# EAGLE design imu_node (EAGLE 9.1.3)
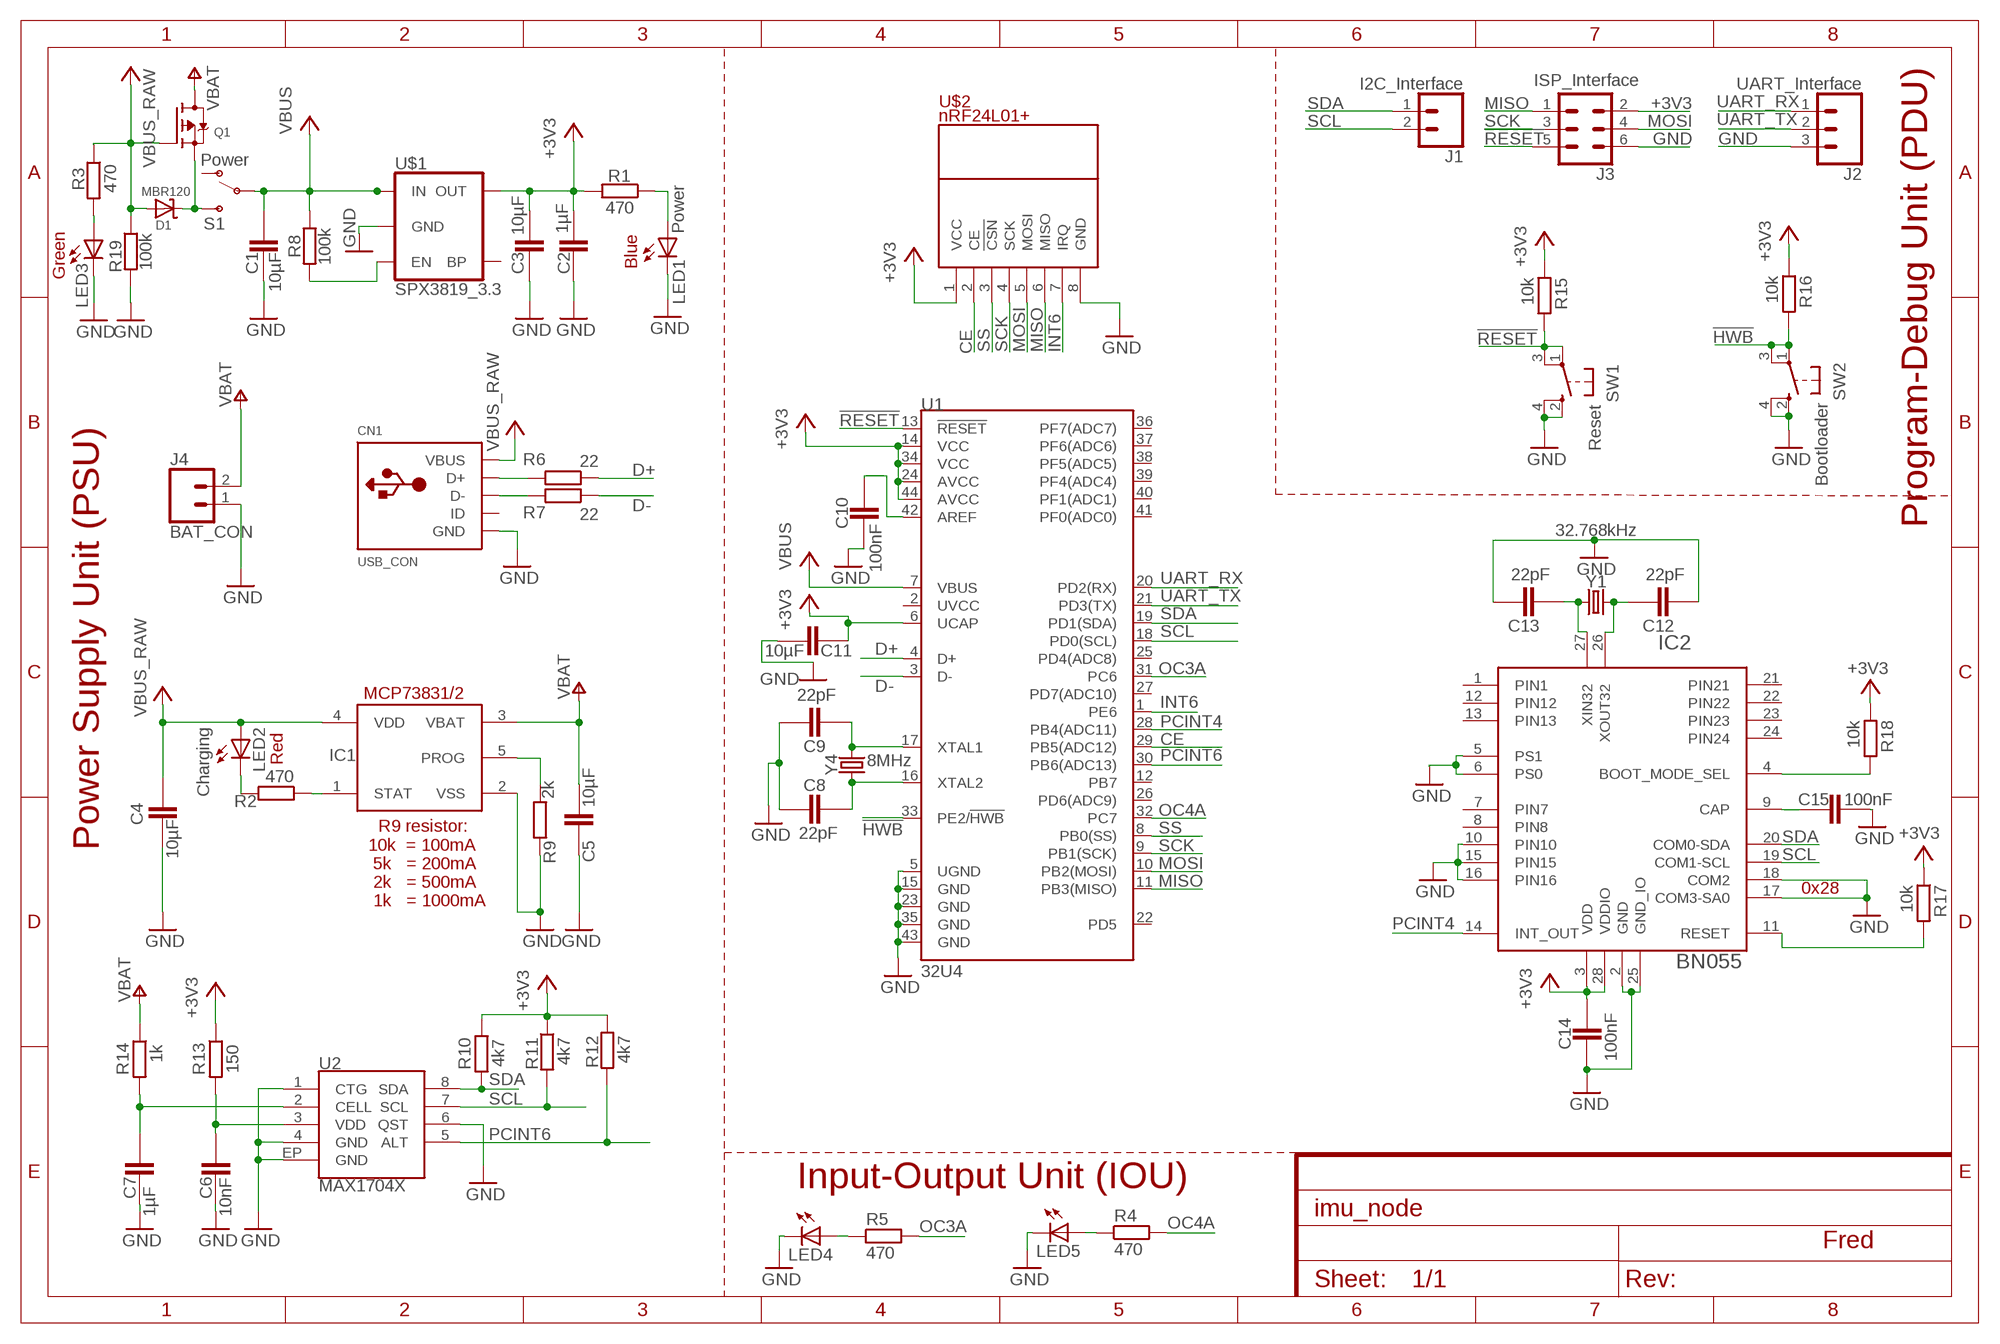
[diagram p0: schematic, sheet 1]

## Parts
C1  10µF  CAPACITOR_0603  [CAPC1608X92N]
C2  1µF  CAPACITOR_0603  [CAPC1608X92N]
C3  10µF  CAPACITOR_0603  [CAPC1608X92N]
C4  10µF  CAPACITOR_0603  [CAPC1608X92N]
C5  10µF  CAPACITOR_0603  [CAPC1608X92N]
C6  10nF  CAPACITOR_0603  [CAPC1608X92N]
C7  1µF  CAPACITOR_0603  [CAPC1608X92N]
C8  22pF  CAPACITOR_0603  [CAPC1608X92N]
C9  22pF  CAPACITOR_0603  [CAPC1608X92N]
C10  100nF  CAPACITOR_0603  [CAPC1608X92N]
C11  10µF  CAPACITOR_0603  [CAPC1608X92N]
C12  22pF  CAPACITOR_0603  [CAPC1608X92N]
C13  22pF  CAPACITOR_0603  [CAPC1608X92N]
C14  100nF  CAPACITOR_0603  [CAPC1608X92N]
C15  100nF  CAPACITOR_0603  [CAPC1608X92N]
CN1  USB_CON  USBMINIB  [USB-MINIB]
D1  MBR120  DIODE_SOD-123FL  [SOD-123FL]
IC1  MCP73831/OT  [SOT23-5L]
IC2  BN055  1658_BNO055  [LGA-28_3.80X5.20/0.5]
J1  I2C_Interface  CONN_02  [1X02]
J2  UART_Interface  CONN_03  [1X03]
J3  ISP_Interface  CONN_03X2FEMALE  [2X3]
J4  BAT_CON  CONN_02  [1X02]
LED1  Power  LEDCHIPLED_0603  [CHIPLED_0603]
LED2  Charging  LEDCHIPLED_0603  [CHIPLED_0603]
LED3  USB  LEDCHIPLED_0603  [CHIPLED_0603]
LED4  LEDCHIPLED_0603  [CHIPLED_0603]
LED5  LEDCHIPLED_0603  [CHIPLED_0603]
Q1  MICROBUILDER_MOSFET-P  [MICROBUILDER_SOT23-R]
R1  470  RESISTOR_0603  [RESC1608X55N]
R2  470  RESISTOR_0603  [RESC1608X55N]
R3  470  RESISTOR_0603  [RESC1608X55N]
R4  470  RESISTOR_0603  [RESC1608X55N]
R5  470  RESISTOR_0603  [RESC1608X55N]
R6  22  RESISTOR_0603  [RESC1608X55N]
R7  22  RESISTOR_0603  [RESC1608X55N]
R8  100k  RESISTOR_0603  [RESC1608X55N]
R9  2k  RESISTOR_0603  [RESC1608X55N]
R10  4k7  RESISTOR_0603  [RESC1608X55N]
R11  4k7  RESISTOR_0603  [RESC1608X55N]
R12  4k7  RESISTOR_0603  [RESC1608X55N]
R13  150  RESISTOR_0603  [RESC1608X55N]
R14  1k  RESISTOR_0603  [RESC1608X55N]
R15  10k  RESISTOR_0603  [RESC1608X55N]
R16  10k  RESISTOR_0603  [RESC1608X55N]
R17  10k  RESISTOR_0603  [RESC1608X55N]
R18  10k  RESISTOR_0603  [RESC1608X55N]
R19  100k  RESISTOR_0603  [RESC1608X55N]
S1  Power  SWITCH-SPDT-SMD-RIGHT-ANGLE  [SWITCH_SPST_SMD_A]
SW1  Reset  SPST_TACT-KMR2  [KMR2]
SW2  Bootloader  SPST_TACT-KMR2  [KMR2]
U1  32U4  ATMEGA32U4TQFP-44  [TQFP44]
U2  MAX1704X  [TDFN-8]
U$1  SPX3819_3.3  V_REG_SPX3819-SOT23-5  [SOT23-5]
U$2  nRF24L01+  6-PIN-BREAKOUT6-PIN-BREAKOUT  [6-PIN-BREAKOUT]
Y1  32.768kHz  CRYSTAL-32.768KHZSMD-3.2X1.5  [CRYSTAL-SMD-3.2X1.5MM]
Y4  8MHz  CRYSTAL-8MHZSMD-5X3.2  [CRYSTAL-SMD-5X3.2-4PAD]

## Nets
!HWB!: R16.2 SW2.1(P) SW2.3(P1) U1.33(PE2/!HWB)
!RESET!: J3.5 R15.2 SW1.1(P) SW1.3(P1) U1.13(!RESET)
+3V3: C2.2 C3.2 C11.1 C14.1 IC2.3(VDD) IC2.28(VDDIO) J3.2 R1.2 R10.1 R11.1 R12.1 R13.1 R15.1 R16.1 R17.1 R18.1 U1.6(UCAP) U1.14(VCC) U1.24(AVCC) U1.34(VCC) U1.44(AVCC) U$1.5(OUT) U$2.1(VCC)
CE: U1.29(PB5(ADC12)) U$2.2(CE)
D+: R6.1 U1.4(D+)
D-: R7.1 U1.3(D-)
GND: C1.1 C2.1 C3.1 C4.1 C5.1 C6.1 C7.1 C8.2 C9.2 C10.2 C11.2 C12.1 C13.2 C14.2 C15.2 CN1.GND IC1.2(VSS) IC2.2(GND) IC2.5(PS1) IC2.6(PS0) IC2.10(PIN10) IC2.15(PIN15) IC2.16(PIN16) IC2.17(COM3-SA0) IC2.18(COM2) IC2.25(GND_IO) J2.3 J3.6 J4.1 LED1.C LED3.C LED4.C LED5.C R9.2 R19.2 SW1.2(S) SW1.4(S1) SW2.2(S) SW2.4(S1) U1.5(UGND) U1.15(GND) U1.23(GND) U1.35(GND) U1.43(GND) U2.1(CTG) U2.4(GND) U2.6(QST) U2.EP(GND) U$1.2(GND) U$2.8(GND)
INT6: U1.1(PE6) U$2.7(IRQ)
MISO: J3.1 U1.11(PB3(MISO)) U$2.6(MISO)
MOSI: J3.4 U1.10(PB2(MOSI)) U$2.5(MOSI)
N$1: CN1.D+ R6.2
N$2: CN1.D- R7.2
N$3: IC1.5(PROG) R9.1
N$4: LED2.C R2.2
N$5: R8.2 U$1.3(EN)
N$6: C13.1 IC2.27(XIN32) Y1.P$1
N$7: LED1.A R1.1
N$8: IC1.1(STAT) R2.1
N$9: LED3.A R3.2
N$10: C9.1 U1.17(XTAL1) Y4.3
N$11: C8.1 U1.16(XTAL2) Y4.1
N$12: C10.1 U1.42(AREF)
N$13: C6.2 R13.2 U2.3(VDD)
N$14: C7.2 R14.2 U2.2(CELL)
N$15: LED4.A R5.1
N$16: C12.2 IC2.26(XOUT32) Y1.P$2
N$17: LED5.A R4.1
N$18: D1.C Q1.2(S) S1.3(S)
N$19: IC2.11(RESET) R17.2
N$20: C15.1 IC2.9(CAP)
N$21: IC2.4(BOOT_MODE_SEL) R18.2
OC3A: R5.2 U1.31(PC6)
OC4A: R4.2 U1.32(PC7)
PCINT4: IC2.14(INT_OUT) U1.28(PB4(ADC11))
PCINT6: R12.2 U1.30(PB6(ADC13)) U2.5(ALT)
SCK: J3.3 U1.9(PB1(SCK)) U$2.4(SCK)
SCL: IC2.19(COM1-SCL) J1.2 R11.2 U1.18(PD0(SCL)) U2.7(SCL)
SDA: IC2.20(COM0-SDA) J1.1 R10.2 U1.19(PD1(SDA)) U2.8(SDA)
SS: U1.8(PB0(SS)) U$2.3(!CSN!)
UART_RX: J2.1 U1.20(PD2(RX))
UART_TX: J2.2 U1.21(PD3(TX))
VBAT: C5.2 IC1.3(VBAT) J4.2 Q1.3(D) R14.1
VBUS: C1.2 R8.1 S1.2(P) U1.7(VBUS) U$1.1(IN)
VBUS_RAW: C4.2 CN1.VBUS D1.A IC1.4(VDD) LED2.A Q1.1(G) R3.1 R19.1
Unconnected: CN1.ID IC2.1(PIN1) IC2.7(PIN7) IC2.8(PIN8) IC2.12(PIN12) IC2.13(PIN13) IC2.21(PIN21) IC2.22(PIN22) IC2.23(PIN23) IC2.24(PIN24) S1.1(O) U1.2(UVCC) U1.12(PB7) U1.22(PD5) U1.25(PD4(ADC8)) U1.26(PD6(ADC9)) U1.27(PD7(ADC10)) U1.36(PF7(ADC7)) U1.37(PF6(ADC6)) U1.38(PF5(ADC5)) U1.39(PF4(ADC4)) U1.40(PF1(ADC1)) U1.41(PF0(ADC0)) U$1.4(BP)

## Notes on the sheet
- Program-Debug Unit (PDU)
- nRF24L01+
- Blue
- Green
- Red
- Power Supply Unit (PSU)
- 0x28
- R9 resistor:
  10k  = 100mA
   5k   = 200mA
   2k   = 500mA
   1k   = 1000mA
- Input-Output Unit (IOU)
- Fred

## Library data of the parts
C1-C15 = ipc-7351-capacitor:CAPACITOR_
CN1 = adafruit:USB: USB Connectors USBMINIB - Surface Mount Female Mini-B USB Connector 4UConnector: 06564 By microbuilder.eu Thru-hole RA Female Mini-B USB Connector 4UConnector: 18732 By ladyada.net
D1 = adafruit:DIODE: Diode SMADIODE - SMA Surface Mount Package 20V 1A Schottky Diode Digikey: 641-1014-6-ND DO-1N4148 - Through Hole Small Current Diode SOD-123 20V 1 A (.5mV Vf) Schottky Diode - Digikey: MBRX120TPMSCT-ND SOD-323 10V 570mA (.38mV Vf, 3ns) Schottky Diode - Digikey: ZLLS410CT-ND SOD-523 30V 30mA Schottky Diode (RB751S-40TE61) - Digikey: RB751S-40TE61CT-ND SOT23-R/W - SOT23 Package (R = Solder Paste/Reflow Ovens, W = Hand-Soldering) BAT54Film 40V 300mA - Digikey: 497-7162-1-ND
IC1 = adafruit:MCP73831: MCP73831/2 Miniature Single-Cell, Fully Integrated Li-Ion, Li-Polymer Charge Management Controllers. Nice and small simple lipoly charge controller, with adjustable current and status output (LED) http://www.ladyada.net/library/pcb/eaglelibrary.html
IC2 = BNO055:1658_BNO055: BN055 Intelligent 9-axis absolute orientation sensor; PART_NUMBER: BNO055
J1 J4 = SparkFun-Connectors:CONN_02: Multi connection point. Often used as Generic Header-pin footprint for 0.1 inch spaced/style header connections On any of the 0.1 inch spaced packages, you can populate with these: Break Away Headers - Straight <https://www.sparkfun.com/products/116> (PRT-00116) Break Away Male Headers - Right Angle <https://www.sparkfun.com/products/553> (PRT-00553) Female Headers <https://www.sparkfun.com/products/115> (PRT-00115) Break Away Headers - Machine Pin <https://www.sparkfun.com/products/117> (PRT-00117) Break Away Female Headers - Swiss Machine Pin <https://www.sparkfun.com/products/743> (PRT-00743) For SCREWTERMINALS and SPRING TERMINALS visit here: Screw Terimnals on SparkFun.com <https://www.sparkfun.com/search/results?term=Screw+Terminals> (5mm/3.5mm/2.54mm spacing) This device is also useful as a general connection point to wire up your design to another part of your project. Our various solder wires solder well into these plated through hole pads. Hook-Up Wire - Assortment (Stranded, 22 AWG) <https://www.sparkfun.com/products/11375> (PRT-11375) Hook-Up Wire - Assortment (Solid Core, 22 AWG) <https://www.sparkfun.com/products/11367> (PRT-11367) View the entire wire category on our website here <https://www.sparkfun.com/categories/141> Special notes: Molex polarized connector foot print use with: PRT-08233 with associated crimp pins and housings. 2.54_SCREWTERM for use with PRT-10571. 3.5mm Screw Terminal footprints for PRT-08084 5mm Screw Terminal footprints for use with PRT-08432
J2 = SparkFun-Connectors:CONN_03: Multi connection point. Often used as Generic Header-pin footprint for 0.1 inch spaced/style header connections On any of the 0.1 inch spaced packages, you can populate with these: Break Away Headers - Straight <https://www.sparkfun.com/products/116> (PRT-00116) Break Away Male Headers - Right Angle <https://www.sparkfun.com/products/553> (PRT-00553) Female Headers <https://www.sparkfun.com/products/115> (PRT-00115) Break Away Headers - Machine Pin <https://www.sparkfun.com/products/117> (PRT-00117) Break Away Female Headers - Swiss Machine Pin <https://www.sparkfun.com/products/743> (PRT-00743) Stackable Header - 3 Pin (Female, 0.1") <https://www.sparkfun.com/products/13875> (PRT-13875) For SCREWTERMINALS and SPRING TERMINALS visit here: Screw Terimnals on SparkFun.com <https://www.sparkfun.com/search/results?term=Screw+Terminals> (5mm/3.5mm/2.54mm spacing) This device is also useful as a general connection point to wire up your design to another part of your project. Our various solder wires solder well into these plated through hole pads. Hook-Up Wire - Assortment (Stranded, 22 AWG) <https://www.sparkfun.com/products/11375> (PRT-11375) Hook-Up Wire - Assortment (Solid Core, 22 AWG) <https://www.sparkfun.com/products/11367> (PRT-11367) View the entire wire category on our website here <https://www.sparkfun.com/categories/141> Special notes: Molex polarized connector foot print use with SKU : PRT-08232 with associated crimp pins and housings.; PROD_ID: XXX-00000; VALUE: 455-1750-1-ND
J3 = SparkFun-Connectors:CONN_03X2: Multi connection point. Often used as Generic Header-pin footprint for 0.1 inch spaced/style header connections You can populate with any combo of single row headers, but if you'd like an exact match, check these: Header - 2x3 (Male, 0.1") <https://www.sparkfun.com/products/12807> (PRT-12807) Header - 2x3 (Female, 0.1") <https://www.sparkfun.com/products/13010> (PRT-13010) 2x3 Pin Shrouded Header <https://www.sparkfun.com/products/10877> (PRT-10877) On any of the 0.1 inch spaced packages, you can populate with these: Break Away Headers - Straight <https://www.sparkfun.com/products/116> (PRT-00116) Break Away Male Headers - Right Angle <https://www.sparkfun.com/products/553> (PRT-00553) Female Headers <https://www.sparkfun.com/products/115> (PRT-00115) Break Away Headers - Machine Pin <https://www.sparkfun.com/products/117> (PRT-00117) Break Away Female Headers - Swiss Machine Pin <https://www.sparkfun.com/products/743> (PRT-00743) Special note: the shrouded connector mates well with our 3x2 ribbon cables: Ribbon Crimp Connector - 6-pin (2x3, Female) <https://www.sparkfun.com/products/10651> (PRT-10651) Ribbon Cable - 6 wire (15ft) <https://www.sparkfun.com/products/10646> (PRT-10646); PROD_ID: CONN-11566; VALUE: FEMALE 2x3
LED1-LED5 = adafruit:LED: LED OSRAM: - CHIPLED LG R971, LG N971, LY N971, LG Q971, LY Q971, LO R971, LY R971 LH N974, LH R974 LS Q976, LO Q976, LY Q976 LO Q996 - Hyper CHIPLED LW Q18S LB Q993, LB Q99A, LB R99A - SideLED LS A670, LO A670, LY A670, LG A670, LP A670 LB A673, LV A673, LT A673, LW A673 LH A674 LY A675 LS A676, LA A676, LO A676, LY A676, LW A676 LS A679, LY A679, LG A679 - Hyper Micro SIDELED® LS Y876, LA Y876, LO Y876, LY Y876 LT Y87S - SmartLED LW L88C, LW L88S LB L89C, LB L89S, LG L890 LS L89K, LO L89K, LY L89K LS L896, LA L896, LO L896, LY L896 - TOPLED LS T670, LO T670, LY T670, LG T670, LP T670 LSG T670, LSP T670, LSY T670, LOP T670, LYG T670 LG T671, LOG T671, LSG T671 LB T673, LV T673, LT T673, LW T673 LH T674 LS T676, LA T676, LO T676, LY T676, LB T676, LH T676, LSB T676, LW T676 LB T67C, LV T67C, LT T67C, LS T67K, LO T67K, LY T67K, LW E67C LS E67B, LA E67B, LO E67B, LY E67B, LB E67C, LV E67C, LT E67C LW T67C LS T679, LY T679, LG T679 LS T770, LO T770, LY T770, LG T770, LP T770 LB T773, LV T773, LT T773, LW T773 LH T774 LS E675, LA E675, LY E675, LS T675 LS T776, LA T776, LO T776, LY T776, LB T776 LHGB T686 LT T68C, LB T68C - Hyper Mini TOPLED® LB M676 - Mini TOPLED Santana® LG M470 LS M47K, LO M47K, LY M47K Source: http://www.osram.convergy.de/
Q1 = Adafruit Feather 328P:MICROBUILDER_MOSFET-P: P-Channel Mosfet LEGEND VDS: Voltage Drain-Source ID: Drain Current RDS(ON): Drain-Source On-State Resistance VGS(TH): Gate-Source Threshold Voltage CISS: Drain-Source Input Capacitance SOT-23 Name VDS ID RDS(ON) VGS(TH) CISS Order Number IRLML5103 30V 760mA 600 mOhm -- 75pF @ 25V Digikey: IRLML5103PBFCT-ND IRLML6401 12V 4.3A 50 mOhm 950mV @ 250µA 830pF @ 10V Digikey: IRLML6401PBFTR-ND NTR0202PL 20V 400mA 800 mOhm 2.3V @ 250uA 70pF @ 5V Digikey: NTR0202PLT1GOSTR-ND NTR4101PT1G 20V 1.8A 85 mOhm 1.2V @ 250uA 675pF @ 10V Digikey: NTR4101PT1GOSCT-ND DMP2004K 20V 600mA 900 mOhm 1V @ 250uA 175pF @ 16V Digikey: DMP2004KDICT-ND PMV65XP 20V 3.9A 76 mOhm 950mV @ 1mA 725pF @ 20V Digikey: 568-2358-2-ND TO-252 Name VDS ID RDS(ON) VGS(TH) CISS Order Number AOD417 30V 25A 34 mOhm 3V @ 250µA 920pF @ 15V Digikey: 785-1106-2-ND PowerPak Name VDS ID RDS(ON) VGS(TH) CISS Order Number AON7401 30V 12A 14 mOhm 3V @ 250µA 2600pF @ 15V Digikey: 785-1302-1-ND
R1-R19 = ipc-7351-resistor:RESISTOR_
S1 = SparkFun-Switches:SWITCH-SPDT: Single Pole, Double Throw (SPDT) Switch Single-pole, double-throw (SPDT) switch. Variant Overview SMD-AYZ0202 Surface Mount DPDT Switch <https://www.sparkfun.com/products/597> (COM-00597) Used on e.g. LilyPad Arduino USB - ATmega32U4 Board <https://www.sparkfun.com/products/12049> PTH-11.6X4.0MM SPDT Mini Power Switch <https://www.sparkfun.com/products/102> (COM-00102) Used on e.g. SparkFun Simon Says - Through-Hole Soldering Kit <https://www.sparkfun.com/products/10547> (KIT-10547) PTH-11.6X4.0MM-KIT KIT version of SPDT Mini Power Switch - Simplifies soldering by removing tStop of switch pins - only one side can be soldered. PTH-11.6X4.0MM-LOCK LOCK version of SPDT Mini Power Switch - Offset pins hold switch in place for easier soldering. SMD-RIGHT-ANGLE Surface Mount Right Angle Switch <https://www.sparkfun.com/products/10860> (COM-10860) Used on e.g. SparkFun ESP8266 Thing <https://www.sparkfun.com/products/13231>; PROD_ID: SWCH-10651; SF_SKU: COM-10860
SW1 SW2 = adafruit:SPST_TACT: SMT 6mm switch, EVQQ2 series http://www.ladyada.net/library/eagle
U1 = SparkFun-IC-Microcontroller:ATMEGA32U4: Atmel MCU, 32KByte Atmel 44-pin 8-bit Microcontroller with 32KBytes of ISP Flash and USB Controller Datasheet <http://cdn.sparkfun.com/datasheets/Dev/Arduino/Boards/ATMega32U4.pdf> SparkFun Products LilyPad Arduino USB - ATmega32U4 Board <https://www.sparkfun.com/products/12049> (DEV-12049) Pro Micro - 5V/16MHz <https://www.sparkfun.com/products/12640> (DEV-12640) Pro Micro - 3.3V/8MHz <https://www.sparkfun.com/products/12587> (DEV-12587) Fio v3 - ATmega32U4 <https://www.sparkfun.com/products/11520> (DEV-11520) Qduino Mini <https://www.sparkfun.com/products/13614> (DEV-13614) Makey Makey - Standard Kit <https://www.sparkfun.com/products/11511> (WIG-11511) Makey Makey Deluxe Kit <https://www.sparkfun.com/products/11519> (WIG-11519); PROD_ID: IC-11161
U2 = SparkFun-IC-Power:MAX1704X: MAX17043/MAX17044: Battery Fuel Guage (43 is 1cell, 44 is 2cell); PROD-ID: IC-10399
U$1 = SparkFun-IC-Power:V_REG_SPX3819: SPX3819 Voltage Regulator 3.3V 500mA, 16V input Datasheet <https://www.exar.com/content/document.ashx?id=22106> SparkFun Products: SparkFun Serial Controlled Motor Driver <https://www.sparkfun.com/products/13911>; PROD_ID: VREG-13321; VALUE: SPX3819M5_3_3
U$2 = SparkFun-nRF24L01+:6-PIN-BREAKOUT
Y1 = SparkFun-Clocks:CRYSTAL-32.768KHZ: 32.768kHz Crystal Frequency: 32.768kHz Frequency Stability: ±20ppm Load Capacitance: 12.5pF (PTH-2X6 & SMD-3.2X1.5), 6pF (SMD-2X6) SparkFun Products: SparkFun BigTime Watch Kit <https://www.sparkfun.com/products/11734> SparkFun nRF52832 Breakout <https://www.sparkfun.com/products/13990> SparkFun Real Time Clock Module <https://www.sparkfun.com/products/12708>; PROD_ID: XTAL-13062
Y4 = SparkFun-Clocks:CRYSTAL-8MHZ: 8MHz Crystal Datasheet Example <http://www.futureelectronics.com/en/technologies/electromechanical/timing-devices/crystals/Pages/6008189-ABM3B-8.000MHZ-B2-T.aspx?IM=0> Frequency: 8MHz Frequency Tolerance: ±20ppm Load Capacitance: 18pF SparkFun Products: Pro Micro -3.3V/8MHz <https://www.sparkfun.com/products/12587> WAV Trigger <https://www.sparkfun.com/products/13660>; PROD_ID: XTAL-09431

## Board
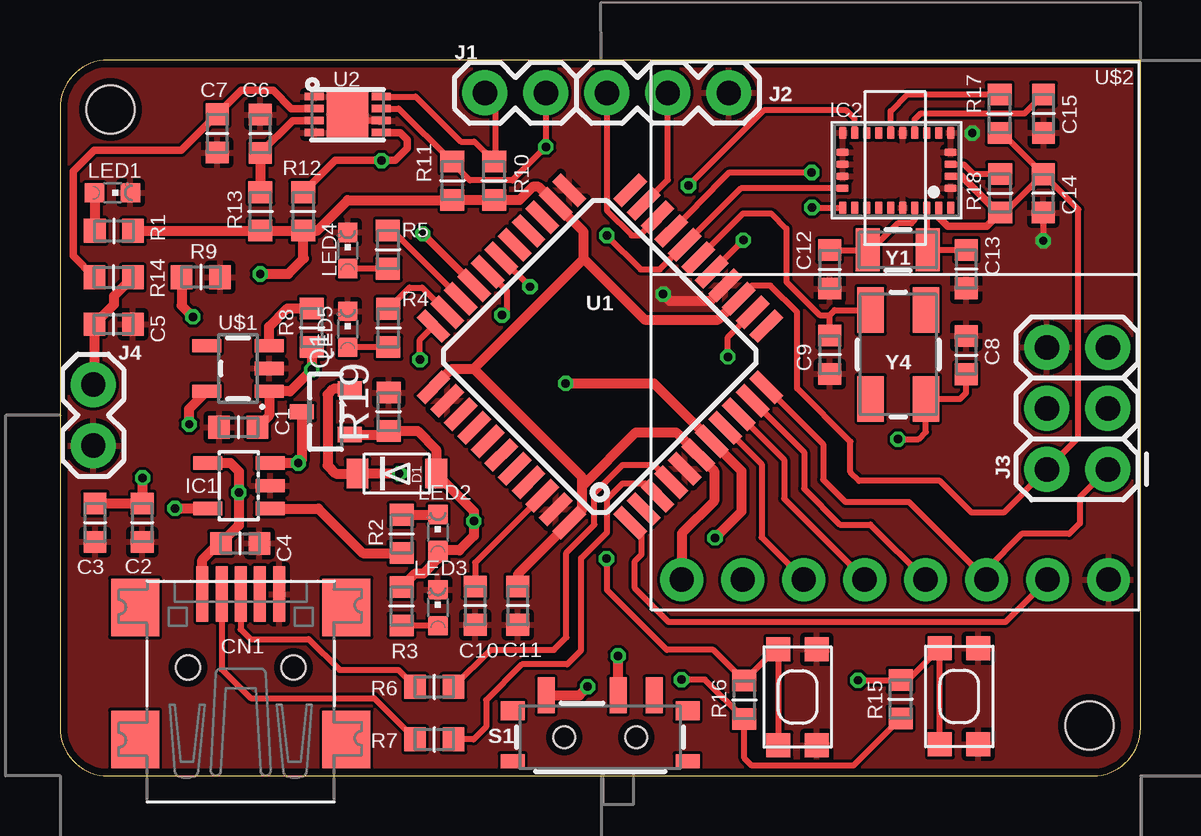
[diagram p1: board, top side]
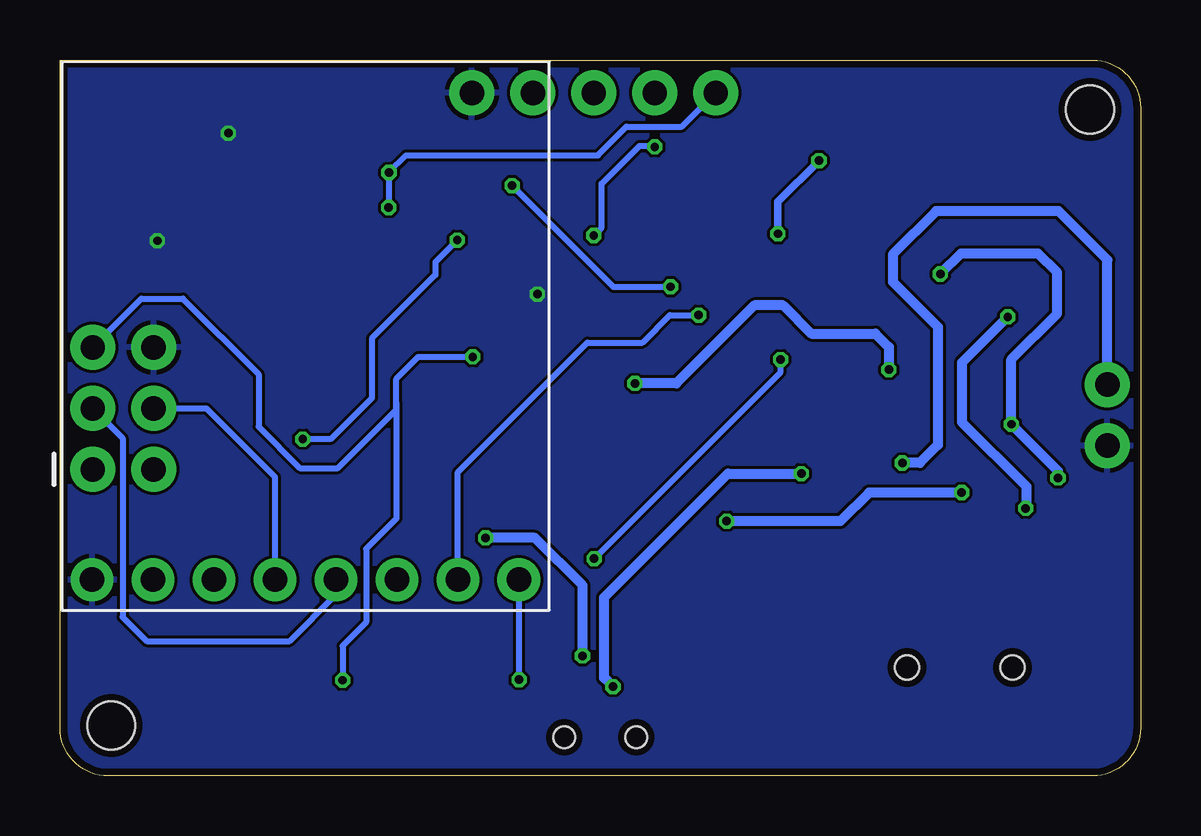
[diagram p2: board, bottom side, seen from below]

Size 45.02 x 29.83 mm. Coordinates in mm from the lower left corner, seen from the top.
Outline: 0,27.83 0,2 arc90 2,0 43.02,0 arc90 45.02,2 45.02,29.83 2,29.83 arc90 0,27.83
Copper layers (1*16): Top 0.035mm / dielectric 1.5mm / Bottom 0.035mm
Design rules "PCB-POOL HighSpec": minimum track width 0.125mm, minimum drill 0.2mm, track to track 0.125mm, track to pad 0.125mm, pad to pad 0.125mm, via to via 0.125mm, smd to smd 0.125mm, copper to edge 0.3mm, drill to drill 0.2mm, minimum pad ring 0.2mm, minimum via ring 0.125mm, stop-mask expansion 0.075mm, vias tented up to drill 0mil, thermal gap 0.2mm
Holes 2 mm at 42.89,2.11 2.11,27.76

### Footprints (pad centres in the part's own frame; a part is rotated, then mirrored left to right if it is on the bottom)
CAPC1608X92N = smd 0.9 x 0.95: 1 -0.8,0; 2 0.8,0
USB-MINIB = smd 0.5 x 2.308: D+ 0,4.064; D- -0.8,4.064; GND 1.6,4.064; ID 0.8,4.064; VBUS -1.6,4.064 | smd 2 x 2.4: GND1 -4.4,-2; GND2 -4.4,3.5; GND3 4.4,3.5; GND4 4.4,-2 | hole 1: -2.2,1; 2.2,1
SOD-123FL = smd 0.91 x 1.22: A 1.637,0; C -1.637,0
SOT23-5L = smd 0.55 x 1.2: 1 -0.95,-1.3; 2 0,-1.3; 3 0.95,-1.3; 4 0.95,1.3; 5 -0.95,1.3
LGA-28_3.80X5.20/0.5 = smd 0.3 x 0.5: 1 -2.25,1.56; 6 -2.25,-1.56; 7 -1.75,-1.56; 8 -1.25,-1.56; 9 -0.75,-1.56; 10 -0.25,-1.56; 11 0.25,-1.56; 12 0.75,-1.56; 13 1.25,-1.56; 14 1.75,-1.56; 15 2.25,-1.56; 20 2.25,1.56; 21 1.75,1.56; 22 1.25,1.56; 23 0.75,1.56; 24 0.25,1.56; 25 -0.25,1.56; 26 -0.75,1.56; 27 -1.25,1.56; 28 -1.75,1.56 | smd 0.5 x 0.3: 2 -2.25,0.75; 3 -2.25,0.25; 4 -2.25,-0.25; 5 -2.25,-0.75; 16 2.25,-0.75; 17 2.25,-0.25; 18 2.25,0.25; 19 2.25,0.75
1X02 = drill 1.016 pad 1.88: 1 0,0; 2 2.54,0
1X03 = drill 1.016 pad 1.88: 1 0,0; 2 2.54,0; 3 5.08,0
2X3 = drill 1.016 pad 1.88: 1 0,0; 2 0,2.54; 3 2.54,0; 4 2.54,2.54; 5 5.08,0; 6 5.08,2.54
CHIPLED_0603 = smd 0.8 x 0.8: A 0,-0.75; C 0,0.75
MICROBUILDER_SOT23-R = smd 0.635 x 1.016: 1 -0.95,-1; 2 0.95,-1; 3 0,1
RESC1608X55N = smd 0.9 x 1: 1 -0.8,0; 2 0.8,0
SWITCH_SPST_SMD_A = smd 0.7 x 1.5: 1 -2.25,-1.75; 2 -0.75,-1.75; 3 2.25,-1.75 | smd 1 x 0.6: GND1 -3.65,1; GND3 3.65,1 | smd 1 x 0.8: GND2 -3.65,-1.1; GND4 3.65,-1.1 | hole 0.9: -1.5,0; 1.5,0
KMR2 = smd 1 x 1: 1 2,0.8; 2 2,-0.8; 3 -2,0.8; 4 -2,-0.8
TQFP44 = smd 1.5 x 0.5: 1 -5.8,4; 2 -5.8,3.2; 3 -5.8,2.4; 4 -5.8,1.6; 5 -5.8,0.8; 6 -5.8,0; 7 -5.8,-0.8; 8 -5.8,-1.6; 9 -5.8,-2.4; 10 -5.8,-3.2; 11 -5.8,-4; 23 5.8,-4; 24 5.8,-3.2; 25 5.8,-2.4; 26 5.8,-1.6; 27 5.8,-0.8; 28 5.8,0; 29 5.8,0.8; 30 5.8,1.6; 31 5.8,2.4; 32 5.8,3.2; 33 5.8,4 | smd 0.5 x 1.5: 12 -4,-5.8; 13 -3.2,-5.8; 14 -2.4,-5.8; 15 -1.6,-5.8; 16 -0.8,-5.8; 17 0,-5.8; 18 0.8,-5.8; 19 1.6,-5.8; 20 2.4,-5.8; 21 3.2,-5.8; 22 4,-5.8; 34 4,5.8; 35 3.2,5.8; 36 2.4,5.8; 37 1.6,5.8; 38 0.8,5.8; 39 0,5.8; 40 -0.8,5.8; 41 -1.6,5.8; 42 -2.4,5.8; 43 -3.2,5.8; 44 -4,5.8
TDFN-8 = smd 0.8 x 0.3: 1 -1.4,0.75; 2 -1.4,0.25; 3 -1.4,-0.25; 4 -1.4,-0.75; 5 1.4,-0.75; 6 1.4,-0.25; 7 1.4,0.25; 8 1.4,0.75 | smd 1.73 x 1.88: EP 0,0
SOT23-5 = smd 0.55 x 1.2: 1 -0.95,-1.3; 2 0,-1.3; 3 0.95,-1.3; 4 0.95,1.3; 5 -0.95,1.3
6-PIN-BREAKOUT = drill 1.016 pad 1.778: 1 0,0; 2 2.54,0; 3 5.08,0; 4 7.62,0; 5 10.16,0; 6 12.7,0; 7 15.24,0; 8 17.78,0
CRYSTAL-SMD-3.2X1.5MM = smd 1 x 1.8: P$1 -1.25,0; P$2 1.25,0
CRYSTAL-SMD-5X3.2-4PAD = smd 1.9 x 1.1: 1 -1.85,-1.15; 2 1.85,-1.15; 3 1.85,1.15; 4 -1.85,1.15

### Placement (x,y rotation side)
C1  7.43,14.53 0 top
C2  3.43,10.55 90 top
C3  1.46,10.55 90 top
C4  7.51,9.69 180 top
C5  2.24,18.82 180 top
C6  8.34,26.76 270 top
C7  6.55,26.77 90 top
C8  37.76,17.54 90 top
C9  32.07,17.55 270 top
C10  17.3,7.1 270 top
C11  19.08,7.1 270 top
C12  32.07,21.11 90 top
C13  37.76,21.12 270 top
C14  40.97,24.27 270 top
C15  40.98,27.6 270 top
CN1  7.53,3.52 0 top
D1  14.03,12.6 0 top
IC1  7.45,12.09 90 top
IC2  34.86,25.23 180 top
J1  17.7,28.46 0 top
J2  22.78,28.46 0 top
J3  43.66,12.78 90 top
J4  1.38,13.77 90 top
LED1  2.18,24.3 270 top
LED2  15.75,10.15 0 top
LED3  15.75,7.01 0 top
LED4  11.99,21.89 0 top
LED5  11.99,18.62 0 top
Q1  11.07,15.18 90 top
R1  2.25,22.71 0 top
R2  14.24,10.08 90 top
R3  14.24,7.07 270 top
R4  13.68,18.67 90 top
R5  13.67,21.93 90 top
R6  15.6,3.71 180 top
R7  15.6,1.52 180 top
R8  10.49,18.68 90 top
R9  5.87,20.79 0 top
R10  18.08,24.8 90 top
R11  16.34,24.8 90 top
R12  10.13,23.52 90 top
R13  8.34,23.52 90 top
R14  2.24,20.78 180 top
R15  35.03,3.2 90 top
R16  28.51,3.17 90 top
R17  39.15,27.6 90 top
R18  39.17,24.28 90 top
R19  13.69,15.18 90 top
S1  22.5,1.61 180 top
SW1  37.47,3.31 90 top
SW2  30.73,3.29 90 top
U1  22.49,17.48 135 top
U2  11.99,27.56 0 top
U$1  7.42,16.98 90 top
U$2  25.91,8.18 0 top
Y1  34.91,21.92 180 top
Y4  34.92,17.56 90 top

### Tracks (layer width: path | path; a pad name or v marks a point on that pad's centre or on a via)
!HWB!  (via drill 0.35)
  Top 0.254: v22.77,9.05 22.78,9.04 22.8,9.04 22.8,7.75 25.29,5.26 27.23,5.26 R16.2 29.83,5.29 SW2.1 SW2.3 | U1.33 15,18.18 v15,17.35
  Bottom 0.254: v22.77,9.05 15,16.83 v15,17.35
!RESET!  (via drill 0.35)
  Top 0.254: v27.83,17.46 27.83,18.28 U1.13 | v33.25,3.99 35.01,3.99 R15.2 | R15.2 35.35,4 | SW1.3 SW1.1 35.35,4 | R15.2 35.35,4
  Bottom 0.254: J3.5 41.63,19.89 39.9,19.89 36.75,16.74 36.75,14.55 35.03,12.83 33.45,12.83 31.01,15.27 31.01,15.53 | 31.01,15.53 31.01,16.55 30.1,17.46 v27.83,17.46 | 31.01,15.53 31.01,10.72 32.27,9.46 32.27,6.4 33.25,5.42 v33.25,3.99
+3V3  (via drill 0.35)
  Top 0.254: R18.1 39.11,23.48 R18.1 39.38,23.48 | R17.1 39.24,26.8 C14.1 | C14.1 39.38,23.48 | 39.38,23.48 | U1.14 28.29,19.89 28.83,20.43 29.6,20.43 30.71,19.33 30.71,16.15 32.93,13.93 32.93,12.66 33.3,12.29 36.66,12.29 37.99,10.97 39.32,10.97 J3.2 42.43,14.08 42.43,23.61 C14.1 | R15.1 33.05,0.43 28.83,0.43 28.51,0.74 R16.1 26.87,4.01 v25.89,4.01
  Top 0.305: IC2.28 36.61,23.28 36.98,22.91 38.61,22.91 R18.1 39.08,23.48 37.88,24.68 | IC2.3 37.58,24.98 37.88,24.68 | 37.88,24.68
  Top 0.406: U1.34 16.33,16.97 17.23,16.97 | 17.23,16.97 21.82,21.55 | 21.82,21.55 21.82,22.67 20.83,23.66 U1.24 19.94,24.55 19.7,24.55 19.14,23.99 R10.1 R11.1 11.99,23.99 10.72,22.72 R12.1 | 21.82,21.55 24.36,19.01 27.42,19.01 U1.14 | U$2.1 25.91,10.11 27.25,11.46 27.25,12.71 U1.6 26.59,13.39 25.67,14.31 23.99,14.31 21.75,12.08 | C11.1 19.07,8.4 U1.44 21.75,11.08 21.75,12.08 | C3.2 C2.2 3.44,11.37 v3.44,12.42 | v5.38,14.66 5.38,15.3 U$1.5 | 21.75,12.08 21.75,12.45 17.23,16.97 | R12.1 R13.1 8.33,22.71 R1.2 | v8.34,20.92 9.51,20.92 10.16,21.57 10.13,21.59 R12.1
  Bottom 0.254: v25.89,4.01 25.89,8.17 U$2.1
  Bottom 0.406: v8.34,20.92 7.49,21.77 4.27,21.77 3.48,20.98 3.48,19.27 5.38,17.36 v5.38,14.66 3.44,12.71 v3.44,12.42
CE  (via drill 0.35)
  Top 0.254: v18.41,19.2 18.63,19.42 18.63,20.21 U1.29
  Bottom 0.254: U$2.2 28.45,12.66 23.05,18.06 20.75,18.06 19.61,19.2 v18.41,19.2
D+
  Top 0.254: R6.1 17.95,5.26 20.57,5.26 21.09,5.78 21.09,9.31 22.26,10.48 22.26,11.77 23.46,12.97 24.74,12.97 U1.4
D-
  Top 0.254: 19.24,4.65 21.13,4.65 21.72,5.23 21.72,9.08 22.8,10.16 22.8,11.54 23.43,12.18 24.39,12.18 U1.3 | 19.24,4.65 | 19.24,4.65 | 19.24,4.65 17.75,3.16 17.75,2.04 17.23,1.52 R7.1
GND  (via drill 0.35)
  Top 0.254: C14.2 v40.97,22.3 | U2.6 12.24,27.31 U2.EP
  Top 0.406: U1.15 27.07,19.79 25.43,19.79 v25.13,20.08
  other vias: 38.01,26.78
  pour Top: 0,27.89 arc-90 1.93,29.82 3.19,29.82 44.97,29.82 44.97,28.59 44.97,1.87 arc-90 43.1,0 2.11,0 arc-90 0,2.11
  pour Bottom: 1.96,29.83 45.01,29.83 45.01,2.02 45.01,1.89 arc-90 43.13,0.01 2.13,0.01 arc-90 0,2.15 0,27.89 arc-90
INT6
  Top 0.254: U$2.7 39.38,6.41 31.53,6.41 25.36,6.41 23.95,7.82 23.95,8.95 24.23,9.23 24.23,10.08 U1.1
MISO
  Top 0.254: U1.11 31.8,13.82 31.8,12.34 32.73,11.42 35.37,11.42 U$2.6 38.61,8.62 40.07,10.08 42.05,10.08 42.49,10.53 42.49,11.61 J3.1
MOSI
  Top 0.254: U1.10 31,13.49 31,11.98 32.5,10.48 33.77,10.48 U$2.5
  Bottom 0.254: J3.4 38.92,15.32 36.07,12.46 U$2.5
N$1
  Top 0.254: CN1.D+ 7.53,6.11 7.94,5.7 10.36,5.7 11.65,4.42 14.08,4.42 R6.2
N$2
  Top 0.254: CN1.D- 6.73,4.45 7.94,3.24 13.09,3.24 14.8,1.54 R7.2
N$3  (via drill 0.35)
  Top 0.406: R9.1 5.07,19.6 v5.54,19.13 | v4.79,11.15 IC1.5
  Bottom 0.406: v5.54,19.13 7.44,17.22 7.44,14.74 4.76,12.06 4.76,11.15 v4.79,11.15
N$4
  Top 0.406: R2.2 15.73,10.88 LED2.C
N$5
  Top 0.406: U$1.3 8.72,18.72 9.47,19.48 | 9.47,19.48 | 9.47,19.48 R8.2
N$6
  Top 0.254: IC2.27 36.11,21.97 Y1.P$1 C13.1 | C13.1
N$7
  Top 0.406: LED1.A 1.45,24.28 R1.1
N$8
  Top 0.406: IC1.1 10.77,11.14 12.62,9.28 R2.1
N$9
  Top 0.254: R3.2 15.73,6.27 LED3.A
N$10
  Top 0.254: C9.1 32.07,19.2 | Y4.3 32.28,19.41 32.07,19.2 | U1.17 28.46,23.44 29.63,23.44 30.26,22.81 30.26,20.59 31.65,19.2 32.07,19.2
N$11  (via drill 0.35)
  Top 0.254: C8.1 37.76,15.96 37.51,15.71 Y4.1 36.08,15.71 36.08,14.34 35.78,14.03 v34.91,14.03 | v28.47,22.33 U1.16
  Bottom 0.254: v28.47,22.33 29.39,21.41 29.39,20.88 32.03,18.24 32.03,15.75 33.74,14.03 v34.91,14.03
N$12
  Top 0.254: U1.42 17.3,8.89 C10.1
N$13
  Top 0.305: C6.2 9.69,27.31 U2.3
  Top 0.406: C6.2 R13.2
N$14
  Top 0.305: U2.2 9.64,27.81 8.89,28.56 7.54,28.56 C7.2 5.05,26.07 1.42,26.07 0.55,25.2 0.55,21.67 R14.2
N$15
  Top 0.254: LED4.A 13.65,21.14 R5.1
N$16
  Top 0.254: C12.2 33.65,21.91 Y1.P$2 33.8,21.92 34.9,23.02 35.47,23.02 35.61,23.17 IC2.26
N$17
  Top 0.254: R4.1 LED5.A
  Top 0.406: LED5.A
N$18  (via drill 0.35)
  Top 0.406: Q1.2 11.39,16.13 11.15,15.89 11.15,12.94 11.49,12.6 D1.C v14.13,12.6 | S1.3 21.64,3.36 21.98,3.71 v21.98,3.72
  Bottom 0.406: v21.98,3.72 22.35,4.09 22.35,7.44 17.2,12.6 v14.13,12.6
N$19
  Top 0.254: IC2.11 34.61,27.7 35.31,28.4 R17.2 | R17.2
N$20
  Top 0.254: IC2.9 35.61,27.36 35.87,27.61 40.2,27.61 C15.1
N$21
  Top 0.254: IC2.4 37.65,25.48 38.05,25.08 R18.2
OC3A
  Top 0.254: U1.31 13.84,22.73 R5.2
OC4A
  Top 0.254: R4.2 14.55,20.34 15.09,20.34 16.12,19.31
  Top 0.406: 16.12,19.31 U1.32
PCINT4  (via drill 0.35)
  Top 0.254: IC2.14 33.11,27.39 32.77,27.74 29.32,27.74 v26.19,24.6 | v19.58,20.38 U1.28 | U1.28
  Bottom 0.254: v26.19,24.6 21.97,20.38 v19.58,20.38
PCINT6  (via drill 0.35)
  Top 0.305: R12.2 11.47,25.65 13.39,25.65 | U1.30 v15.11,22.59 | 13.39,25.65 v13.4,25.64 | U2.5 14.19,26.81 14.48,26.52 14.48,26.16 13.97,25.65 13.39,25.65
  Bottom 0.305: v13.4,25.64 15.11,23.93 v15.11,22.59
SCK
  Top 0.254: U1.9 30.18,13.19 30.18,11.56 33.53,8.2 U$2.4
  Bottom 0.254: J3.3 42.42,14.07 42.42,6.62 41.41,5.61 35.46,5.61 33.53,7.54 U$2.4
SCL  (via drill 0.35)
  Top 0.254: IC2.19 28.37,24.48 26.14,22.26 | 26.14,22.26 U1.18 | v22.78,22.52 24.19,21.11 24.99,21.11 26.14,22.26 | U2.7 14.11,27.81 16.32,25.6 R11.2 16.34,25.55 17.08,24.82 18.85,24.82 v20.24,26.21 J1.2
  Bottom 0.254: v22.78,22.52 22.45,22.85 22.45,24.68 20.88,26.25 20.27,26.25 20.27,26.24 v20.24,26.21
SDA  (via drill 0.35)
  Top 0.254: U1.19 26.54,23.79 26.54,23.8 27.89,25.15 v31.32,25.15 | v31.33,23.69 32.6,23.69 IC2.20 | U2.8 14.82,28.31 16.7,26.43 17.26,26.43 R10.2 18.14,25.65 18.14,26.72 18.14,28.03 J1.1
  Bottom 0.254: v31.33,23.69 31.32,23.69 v31.32,25.15 30.61,25.86 22.62,25.86 21.43,27.05 19.11,27.05 J1.1
SS
  Top 0.254: U1.8 29.23,12.99 29.23,9.94 30.99,8.19 U$2.3
UART_RX
  Top 0.254: U1.20 24.16,22.53 23.81,22.53 22.78,23.56 J2.1
UART_TX
  Top 0.254: U1.21 25.32,24.83 J2.2
VBAT  (via drill 0.35)
  Top 0.406: R14.1 2.25,19.99 2.25,19.63 C5.2 1.44,16.36 J4.2 | Q1.3 10.07,13.19 v9.93,13.04 IC1.3
  Bottom 0.406: J4.2 1.38,21.5 3.42,23.53 8.52,23.53 10.32,21.73 10.32,20.59 8.45,18.71 8.45,13.79 9.2,13.04 v9.93,13.04
VBUS  (via drill 0.35)
  Top 0.406: S1.2 v23.25,5 | v27.29,9.92 28.4,11.02 28.4,12.7 U1.7 24.74,16.36 v21.07,16.36 | C1.2 8.72,15.02 U$1.1 9.59,16.03 v10.49,16.93 R8.1
  Bottom 0.406: v23.25,5 23.25,7.94 25.23,9.92 v27.29,9.92 | v21.07,16.36 19.34,16.36 16.09,19.61 14.9,19.61 13.72,18.43 11.05,18.43 R8.1 v10.49,16.93
VBUS_RAW  (via drill 0.35)
  Top 0.406: R3.1 14.81,8.45 15.15,8.45 15.75,9.04 LED2.A 16.64,9.4 17.25,10.01 v17.25,10.62 17.25,11.02 D1.A 15.67,13.6 14.9,14.38 R19.1 13.54,14.23 Q1.1 | 6.83,13.04 IC1.4 7.1,13.04 7.46,12.69 v7.46,11.81 7.46,10.44 C4.2 6.62,9.69 5.93,9.01 CN1.VBUS
  Bottom 0.406: v7.46,11.81 11.32,11.81 12.51,10.62 v17.25,10.62